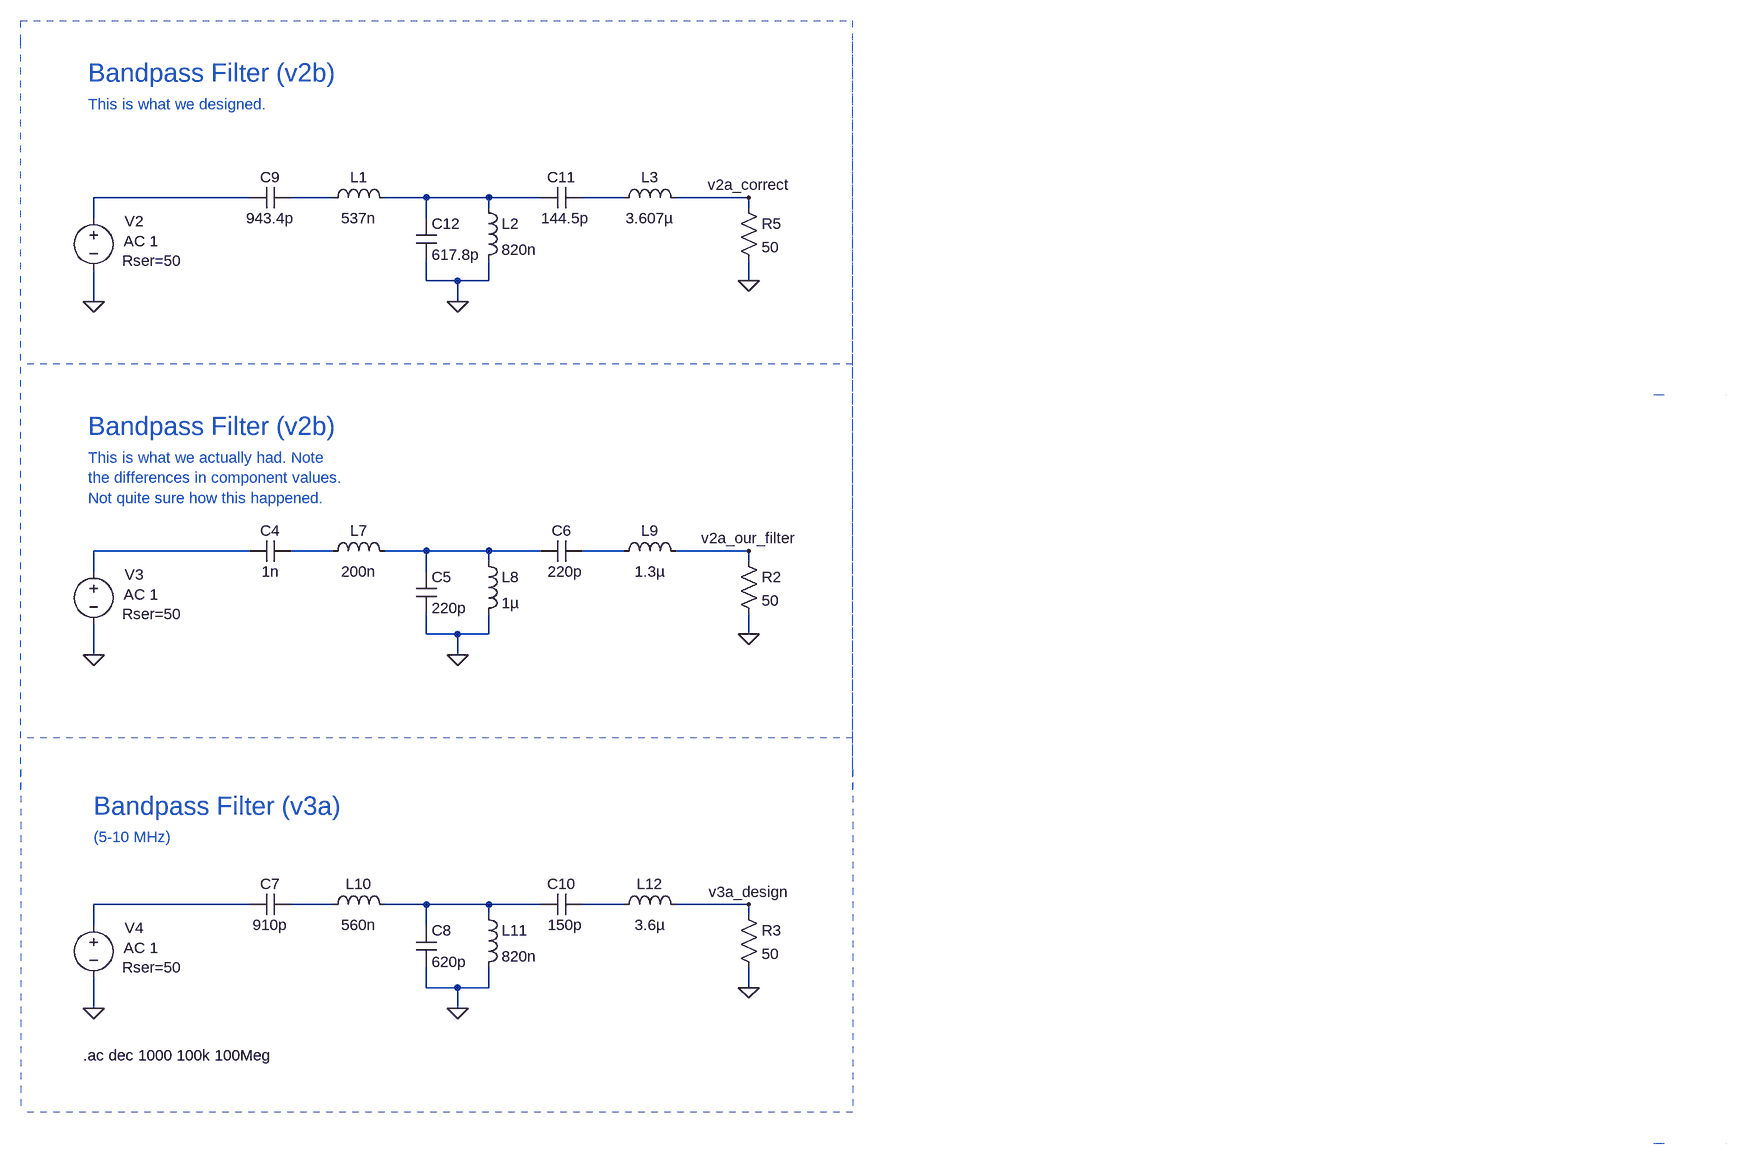
[diagram p0: schematic BandpassFilterSimulations.asc]
BandpassFilterSimulations.asc, the LTspice schematic file:
Version 4
SHEET 1 2332 3096
WIRE -304 -976 -544 -976
WIRE -176 -976 -240 -976
WIRE -32 -976 -96 -976
WIRE 64 -976 -32 -976
WIRE 144 -976 64 -976
WIRE 272 -976 208 -976
WIRE 464 -976 352 -976
WIRE 64 -960 64 -976
WIRE 464 -960 464 -976
WIRE -544 -944 -544 -976
WIRE -32 -944 -32 -976
WIRE -32 -848 -32 -880
WIRE 16 -848 -32 -848
WIRE 64 -848 64 -880
WIRE 64 -848 16 -848
WIRE 464 -848 464 -880
WIRE -544 -816 -544 -864
WIRE 16 -816 16 -848
WIRE -304 -432 -544 -432
WIRE -176 -432 -240 -432
WIRE -32 -432 -96 -432
WIRE 64 -432 -32 -432
WIRE 144 -432 64 -432
WIRE 272 -432 208 -432
WIRE 464 -432 352 -432
WIRE 64 -416 64 -432
WIRE 464 -416 464 -432
WIRE -544 -400 -544 -432
WIRE -32 -400 -32 -432
WIRE -32 -304 -32 -336
WIRE 16 -304 -32 -304
WIRE 64 -304 64 -336
WIRE 64 -304 16 -304
WIRE 464 -304 464 -336
WIRE -544 -272 -544 -320
WIRE 16 -272 16 -304
WIRE -304 112 -544 112
WIRE -176 112 -240 112
WIRE -32 112 -96 112
WIRE 64 112 -32 112
WIRE 144 112 64 112
WIRE 272 112 208 112
WIRE 464 112 352 112
WIRE 64 128 64 112
WIRE 464 128 464 112
WIRE -544 144 -544 112
WIRE -32 144 -32 112
WIRE -32 240 -32 208
WIRE 16 240 -32 240
WIRE 64 240 64 208
WIRE 64 240 16 240
WIRE 464 240 464 208
WIRE -544 272 -544 224
WIRE 16 272 16 240
FLAG 464 -848 0
FLAG 16 -816 0
FLAG -544 -816 0
FLAG 464 -304 0
FLAG 16 -272 0
FLAG -544 -272 0
FLAG 464 -976 v2a_correct
FLAG 464 -432 v2a_our_filter
FLAG 464 240 0
FLAG 16 272 0
FLAG -544 272 0
FLAG 464 112 v3a_design
SYMBOL cap -240 -992 R90
WINDOW 0 0 32 VBottom 2
WINDOW 3 32 32 VTop 2
SYMATTR InstName C9
SYMATTR Value 943.4p
SYMBOL ind -192 -960 R270
WINDOW 0 32 56 VTop 2
WINDOW 3 0 56 VBottom 2
SYMATTR InstName L1
SYMATTR Value 537n
SYMBOL cap -48 -944 R0
SYMATTR InstName C12
SYMATTR Value 617.8p
SYMBOL ind 48 -976 R0
SYMATTR InstName L2
SYMATTR Value 820n
SYMBOL cap 208 -992 R90
WINDOW 0 0 32 VBottom 2
WINDOW 3 32 26 VTop 2
SYMATTR InstName C11
SYMATTR Value 144.5p
SYMBOL ind 256 -960 R270
WINDOW 0 32 56 VTop 2
WINDOW 3 0 56 VBottom 2
SYMATTR InstName L3
SYMATTR Value 3.607µ
SYMBOL res 448 -976 R0
SYMATTR InstName R5
SYMATTR Value 50
SYMBOL voltage -544 -960 R0
WINDOW 123 46 51 Left 2
WINDOW 39 44 81 Left 2
WINDOW 0 48 20 Left 2
SYMATTR Value2 AC 1
SYMATTR SpiceLine Rser=50
SYMATTR InstName V2
SYMATTR Value ""
SYMBOL cap -240 -448 R90
WINDOW 0 0 32 VBottom 2
WINDOW 3 32 32 VTop 2
SYMATTR InstName C4
SYMATTR Value 1n
SYMBOL ind -192 -416 R270
WINDOW 0 32 56 VTop 2
WINDOW 3 0 56 VBottom 2
SYMATTR InstName L7
SYMATTR Value 200n
SYMBOL cap -48 -400 R0
SYMATTR InstName C5
SYMATTR Value 220p
SYMBOL ind 48 -432 R0
SYMATTR InstName L8
SYMATTR Value 1µ
SYMBOL cap 208 -448 R90
WINDOW 0 0 32 VBottom 2
WINDOW 3 32 26 VTop 2
SYMATTR InstName C6
SYMATTR Value 220p
SYMBOL ind 256 -416 R270
WINDOW 0 32 56 VTop 2
WINDOW 3 0 56 VBottom 2
SYMATTR InstName L9
SYMATTR Value 1.3µ
SYMBOL res 448 -432 R0
SYMATTR InstName R2
SYMATTR Value 50
SYMBOL voltage -544 -416 R0
WINDOW 123 46 51 Left 2
WINDOW 39 44 81 Left 2
WINDOW 0 48 20 Left 2
SYMATTR Value2 AC 1
SYMATTR SpiceLine Rser=50
SYMATTR InstName V3
SYMATTR Value ""
SYMBOL cap -240 96 R90
WINDOW 0 0 32 VBottom 2
WINDOW 3 32 32 VTop 2
SYMATTR InstName C7
SYMATTR Value 910p
SYMBOL ind -192 128 R270
WINDOW 0 32 56 VTop 2
WINDOW 3 0 56 VBottom 2
SYMATTR InstName L10
SYMATTR Value 560n
SYMBOL cap -48 144 R0
SYMATTR InstName C8
SYMATTR Value 620p
SYMBOL ind 48 112 R0
SYMATTR InstName L11
SYMATTR Value 820n
SYMBOL cap 208 96 R90
WINDOW 0 0 32 VBottom 2
WINDOW 3 32 26 VTop 2
SYMATTR InstName C10
SYMATTR Value 150p
SYMBOL ind 256 128 R270
WINDOW 0 32 56 VTop 2
WINDOW 3 0 56 VBottom 2
SYMATTR InstName L12
SYMATTR Value 3.6µ
SYMBOL res 448 112 R0
SYMATTR InstName R3
SYMATTR Value 50
SYMBOL voltage -544 128 R0
WINDOW 123 46 51 Left 2
WINDOW 39 44 81 Left 2
WINDOW 0 48 20 Left 2
SYMATTR Value2 AC 1
SYMATTR SpiceLine Rser=50
SYMATTR InstName V4
SYMATTR Value ""
TEXT -552 -1168 Left 4 ;Bandpass Filter (v2b)
TEXT -552 -1120 Left 2 ;This is what we designed.
TEXT -552 -624 Left 4 ;Bandpass Filter (v2b)
TEXT -552 -576 Left 2 ;This is what we actually had. Note \nthe differences in component values.\nNot quite sure how this happened.
TEXT -544 -40 Left 4 ;Bandpass Filter (v3a)
TEXT -560 344 Left 2 !.ac dec 1000 100k 100Meg
TEXT -544 8 Left 2 ;(5-10 MHz)
LINE Normal 1872 -672 1856 -672 2
LINE Normal 1872 -672 1872 -672 2
LINE Normal 1872 -672 1872 -672 2
LINE Normal 1968 -672 1968 -672 2
LINE Normal 624 -96 624 -1248 2
LINE Normal 1872 480 1856 480 2
LINE Normal 1872 480 1872 480 2
LINE Normal 1872 480 1872 480 2
LINE Normal 1968 480 1968 480 2
LINE Normal 624 -64 624 -1216 2
LINE Normal -656 -64 -656 -1216 2
LINE Normal 624 432 -656 432 2
LINE Normal 624 -96 624 432 2
LINE Normal -656 -96 -656 432 2
LINE Normal -656 -1248 624 -1248 2
LINE Normal -656 -1216 -656 -1248 2
LINE Normal 624 -720 -656 -720 2
LINE Normal 624 -144 -656 -144 2

The netlist it stands for:
* BandpassFilterSimulations.asc
C9 N002 N001 943.4p
L1 N002 N003 537n
C12 N003 0 617.8p
L2 N003 0 820n
C11 N004 N003 144.5p
L3 N004 v2a_correct 3.607µ
R5 v2a_correct 0 50
V2 N001 0 AC 1 Rser=50
C4 N006 N005 1n
L7 N006 N007 200n
C5 N007 0 220p
L8 N007 0 1µ
C6 N008 N007 220p
L9 N008 v2a_our_filter 1.3µ
R2 v2a_our_filter 0 50
V3 N005 0 AC 1 Rser=50
C7 N010 N009 910p
L10 N010 N011 560n
C8 N011 0 620p
L11 N011 0 820n
C10 N012 N011 150p
L12 N012 v3a_design 3.6µ
R3 v3a_design 0 50
V4 N009 0 AC 1 Rser=50
* Bandpass Filter (v2b)
* This is what we designed.
* Bandpass Filter (v2b)
* This is what we actually had. Note
* the differences in component values.
* Not quite sure how this happened.
* Bandpass Filter (v3a)
.ac dec 1000 100k 100Meg
* (5-10 MHz)
.backanno
.end